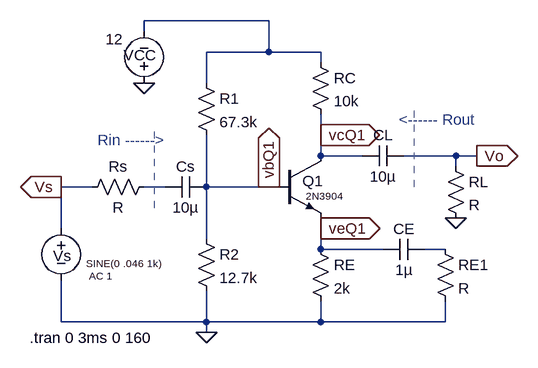
[diagram p0: schematic CE_active-region.asc]
CE_active-region.asc, the LTspice schematic file:
Version 4
SHEET 1 936 680
WIRE 96 -96 -96 -96
WIRE -96 -80 -96 -96
WIRE 96 -48 96 -96
WIRE 96 -48 0 -48
WIRE 176 -48 96 -48
WIRE 176 -32 176 -48
WIRE 0 0 0 -48
WIRE 176 80 176 48
WIRE 176 112 176 80
WIRE 240 112 176 112
WIRE 384 112 304 112
WIRE 416 112 384 112
WIRE 384 128 384 112
WIRE -176 160 -224 160
WIRE -64 160 -96 160
WIRE 0 160 0 80
WIRE 96 160 0 160
WIRE 112 160 96 160
WIRE -224 224 -224 160
WIRE 176 224 176 208
WIRE 0 240 0 160
WIRE 176 256 176 224
WIRE 272 256 176 256
WIRE 368 256 336 256
WIRE -224 368 -224 304
WIRE 0 368 0 320
WIRE 0 368 -224 368
WIRE 176 368 176 336
WIRE 176 368 0 368
WIRE 368 368 368 336
WIRE 368 368 176 368
WIRE 0 384 0 368
FLAG -96 0 0
FLAG 0 384 0
FLAG 96 160 vbQ1
IOPIN 96 160 Out
FLAG 176 224 veQ1
IOPIN 176 224 Out
FLAG 176 80 vcQ1
IOPIN 176 80 Out
FLAG -224 160 Vs
IOPIN -224 160 Out
FLAG 384 208 0
FLAG 416 112 Vo
IOPIN 416 112 Out
SYMBOL npn 112 112 R0
WINDOW 0 36 39 Left 2
WINDOW 3 41 62 Left 1
SYMATTR InstName Q1
SYMATTR Value 2N3904
SYMBOL cap 304 96 R90
WINDOW 0 0 32 VBottom 2
WINDOW 3 32 32 VTop 2
SYMATTR InstName CL
SYMATTR Value 10µ
SYMBOL res -16 -16 R0
SYMATTR InstName R1
SYMATTR Value 67.3k
SYMBOL res -16 224 R0
SYMATTR InstName R2
SYMATTR Value 12.7k
SYMBOL res 160 -48 R0
SYMATTR InstName RC
SYMATTR Value 10k
SYMBOL res 160 240 R0
SYMATTR InstName RE
SYMATTR Value 2k
SYMBOL voltage -96 16 R180
WINDOW 0 -19 59 Left 2
WINDOW 3 32 84 Left 2
SYMATTR InstName VCC
SYMATTR Value 12
SYMBOL voltage -224 208 R0
WINDOW 0 -12 58 Left 2
WINDOW 3 39 70 Left 1
WINDOW 123 43 89 Left 1
WINDOW 39 0 0 Left 0
SYMATTR InstName Vs
SYMATTR Value SINE(0 .046 1k)
SYMATTR Value2 AC 1
SYMBOL cap 336 240 R90
WINDOW 0 0 32 VBottom 2
WINDOW 3 32 32 VTop 2
SYMATTR InstName CE
SYMATTR Value 1µ
SYMBOL cap 0 144 R90
WINDOW 0 0 32 VBottom 2
WINDOW 3 32 32 VTop 2
SYMATTR InstName Cs
SYMATTR Value 10µ
SYMBOL res 368 112 R0
SYMATTR InstName RL
SYMBOL res 352 240 R0
SYMATTR InstName RE1
SYMBOL res -80 144 R90
WINDOW 0 0 56 VBottom 2
WINDOW 3 32 56 VTop 2
SYMATTR InstName Rs
TEXT -272 392 Left 2 !.tran 0 3ms 0 160
TEXT -168 88 Left 2 ;Rin ------>
TEXT 296 56 Left 2 ;<------ Rout
LINE Normal -80 192 -80 64 2
LINE Normal 320 160 320 32 2

The netlist it stands for:
* CE_active-region.asc
Q1 vcQ1 vbQ1 veQ1 0 2N3904
CL Vo vcQ1 10µ
R1 N001 vbQ1 67.3k
R2 vbQ1 0 12.7k
RC N001 vcQ1 10k
RE veQ1 0 2k
VCC 0 N001 12
Vs Vs 0 SINE(0 .046 1k) AC 1
CE N003 veQ1 1µ
Cs vbQ1 N002 10µ
RL Vo 0 R
RE1 N003 0 R
Rs N002 Vs R
.model NPN NPN
.model PNP PNP
.lib standard.bjt
.tran 0 3ms 0 160
* Rin ------>
* <------ Rout
.backanno
.end